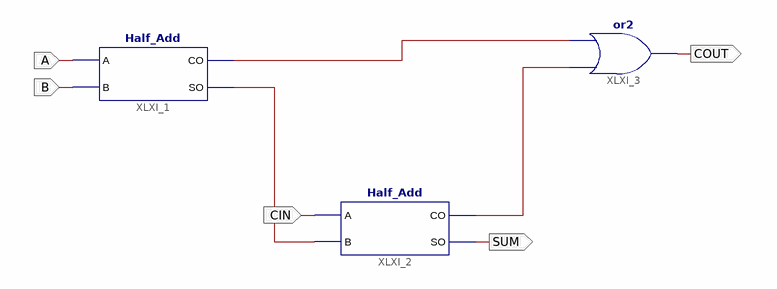
[diagram p0: schematic sheet 1]
// Xilinx ISE schematic All_Add.sch (virtex4) as structural Verilog: 3 symbols, 5 ports
module All_Add (
  input  CIN,
  input  B,
  input  A,
  output COUT,
  output SUM
);

  wire XLXN_1, XLXN_7, XLXN_8;

  Half_Add XLXI_1 (.A(A), .B(B), .CO(XLXN_7), .SO(XLXN_1));
  Half_Add XLXI_2 (.A(CIN), .B(XLXN_1), .CO(XLXN_8), .SO(SUM));
  or XLXI_3 (COUT, XLXN_8, XLXN_7);
endmodule
